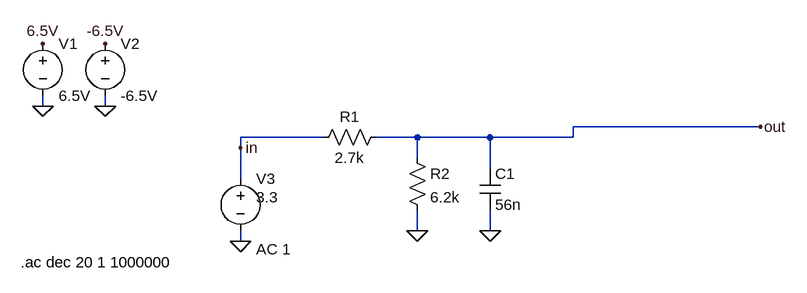
[diagram p0: schematic Pulse_Width_PWM.asc]
Pulse_Width_PWM.asc, the LTspice schematic file:
Version 4
SHEET 1 880 680
WIRE -528 192 -528 176
WIRE -432 192 -432 176
WIRE 576 224 288 224
WIRE -96 240 -224 240
WIRE 48 240 -16 240
WIRE 160 240 48 240
WIRE 288 240 288 224
WIRE 288 240 160 240
WIRE -224 256 -224 240
WIRE 48 272 48 240
WIRE 160 288 160 240
WIRE -224 304 -224 256
WIRE 48 384 48 352
WIRE 160 384 160 352
WIRE -224 400 -224 384
FLAG -432 192 0
FLAG -528 192 0
FLAG -432 96 -6.5V
FLAG -224 400 0
FLAG -224 256 in
FLAG -528 96 6.5V
FLAG 576 224 out
FLAG 48 384 0
FLAG 160 384 0
DATAFLAG 512 224 ""
DATAFLAG -160 240 ""
SYMBOL voltage -528 80 R0
WINDOW 123 0 0 Left 0
WINDOW 39 0 0 Left 0
SYMATTR InstName V1
SYMATTR Value 6.5V
SYMBOL voltage -432 80 R0
WINDOW 123 0 0 Left 0
WINDOW 39 0 0 Left 0
SYMATTR InstName V2
SYMATTR Value -6.5V
SYMBOL voltage -224 288 R0
WINDOW 3 24 44 Left 2
WINDOW 123 24 124 Left 2
WINDOW 39 0 0 Left 0
SYMATTR Value 3.3
SYMATTR Value2 AC 1
SYMATTR InstName V3
SYMBOL res 0 224 R90
WINDOW 0 0 56 VBottom 2
WINDOW 3 32 56 VTop 2
SYMATTR InstName R1
SYMATTR Value 2.7k
SYMBOL res 32 256 R0
SYMATTR InstName R2
SYMATTR Value 6.2k
SYMBOL cap 144 288 R0
SYMATTR InstName C1
SYMATTR Value 56n
TEXT -562 432 Left 2 !.ac dec 20 1 1000000

The netlist it stands for:
* Pulse_Width_PWM.asc
V1 6.5V 0 6.5V
V2 -6.5V 0 -6.5V
V3 in 0 3.3 AC 1
R1 out in 2.7k
R2 out 0 6.2k
C1 out 0 56n
.ac dec 20 1 1000000
.backanno
.end